# EAGLE design BareBonesArduino (EAGLE 7.2.0)
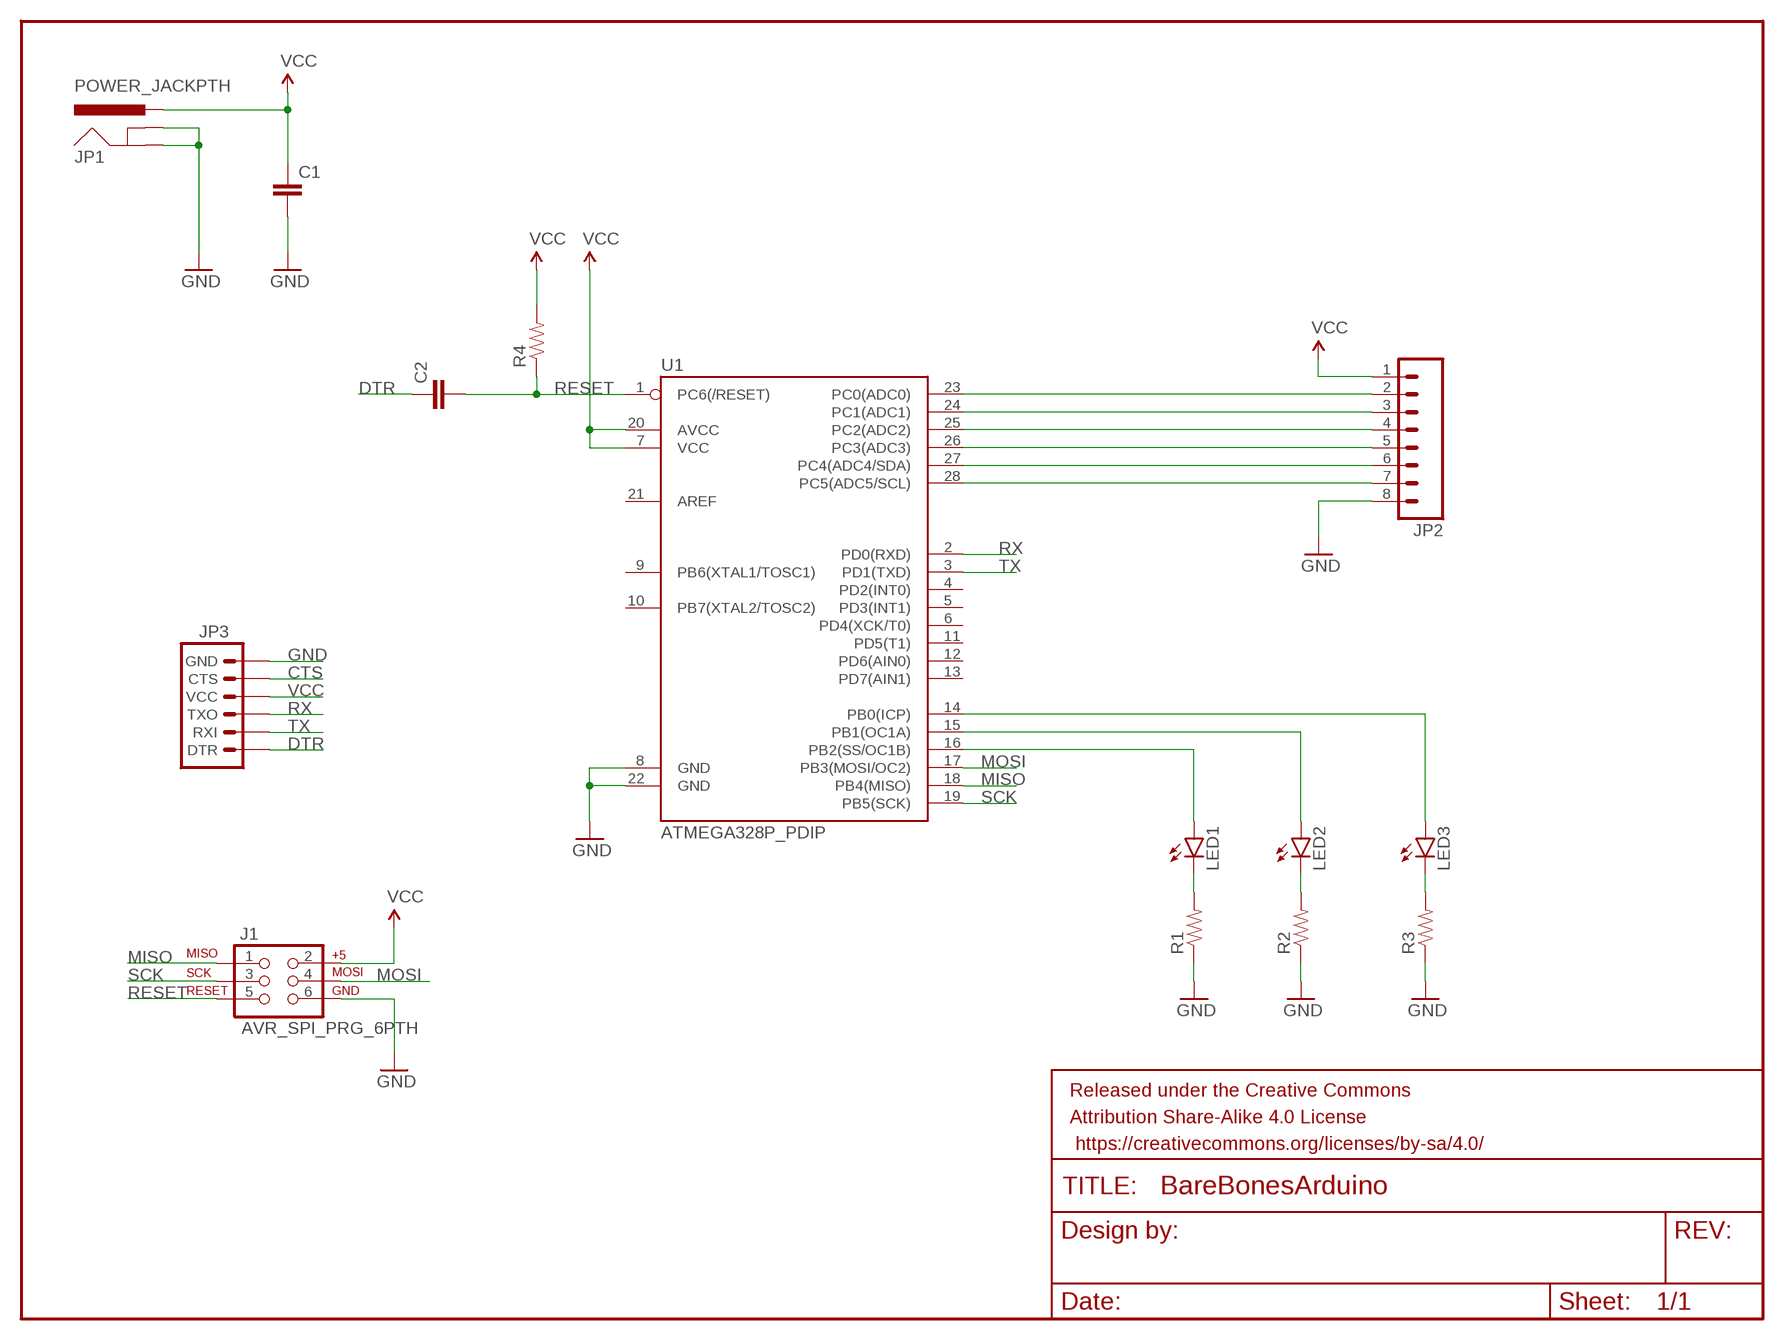
[diagram p0: schematic, sheet 1]

## Parts
C1  CAPPTH  [CAP-PTH-SMALL]
C2  CAPPTH  [CAP-PTH-SMALL]
FRAME1  FRAME-LETTER  [CREATIVE_COMMONS]
J1  AVR_SPI_PRG_6PTH  [2X3]
JP1  POWER_JACKPTH  [POWER_JACK_PTH]
JP2  M08  [1X08_ROUND]
JP3  ARDUINO_SERIAL_PROGRAMPTH  [1X06]
LED1  LED5MM  [LED5MM]
LED2  LED5MM  [LED5MM]
LED3  LED5MM  [LED5MM]
R1  RESISTORPTH-1/4W  [AXIAL-0.4]
R2  RESISTORPTH-1/4W  [AXIAL-0.4]
R3  RESISTORPTH-1/4W  [AXIAL-0.4]
R4  RESISTORPTH-1/4W  [AXIAL-0.4]
U1  ATMEGA328P_PDIP  [DIL28-3]

## Nets
CTS: JP3.5(CTS)
DTR: C2.1 JP3.1(DTR)
GND: C1.2 J1.6 JP1.GND JP1.GNDBREAK JP2.8 JP3.6(GND) R1.P$1 R2.P$1 R3.P$1 U1.8(GND) U1.22(GND)
MISO: J1.1 U1.18(PB4(MISO))
MOSI: J1.4 U1.17(PB3(MOSI/OC2))
N$2: LED3.K(C) R3.P$2
N$3: LED2.K(C) R2.P$2
N$4: LED1.K(C) R1.P$2
N$5: LED1.A U1.16(PB2(SS/OC1B))
N$6: LED2.A U1.15(PB1(OC1A))
N$7: LED3.A U1.14(PB0(ICP))
N$8: JP2.7 U1.28(PC5(ADC5/SCL))
N$9: JP2.6 U1.27(PC4(ADC4/SDA))
N$10: JP2.5 U1.26(PC3(ADC3))
N$11: JP2.4 U1.25(PC2(ADC2))
N$12: JP2.3 U1.24(PC1(ADC1))
N$13: JP2.2 U1.23(PC0(ADC0))
RESET: C2.2 J1.5 R4.P$1 U1.1(PC6(/RESET))
RX: JP3.3(TXO) U1.2(PD0(RXD))
SCK: J1.3 U1.19(PB5(SCK))
TX: JP3.2(RXI) U1.3(PD1(TXD))
VCC: C1.1 J1.2 JP1.PWR JP2.1 JP3.4(VCC) R4.P$2 U1.7(VCC) U1.20(AVCC)
Unconnected: U1.4(PD2(INT0)) U1.5(PD3(INT1)) U1.6(PD4(XCK/T0)) U1.9(PB6(XTAL1/TOSC1)) U1.10(PB7(XTAL2/TOSC2)) U1.11(PD5(T1)) U1.12(PD6(AIN0)) U1.13(PD7(AIN1)) U1.21(AREF)

## Library data of the parts
C1 C2 = SparkFun-Capacitors:CAP: Capacitor Standard 0603 ceramic capacitor, and 0.1" leaded capacitor.
FRAME1 = SparkFun-Aesthetics:FRAME-LETTER: Schematic Frame Standard 8.5x11 US Letter frame
J1 = SparkFun-Connectors:AVR_SPI_PRG_6: AVR ISP 6 Pin This is the reduced ISP connector for AVR programming. Common on Arduino. This footprint will take up less PCB space and can be used with a 10-pin to 6-pin adapter such as SKU: BOB-08508 **Special note about "TEST_POINT" package. The stop mask is on the top side, so if you want your programming test points to be on the bottom of your board, make sure to place this package on the bottom side of the board. This also ensure that the orientation to program from the bottom side will be correct.
JP1 = SparkFun-Connectors:POWER_JACK: Power Jack This is the standard 5.5mm barrel jack for power. The PTH is the most common, proven, reliable, footprint. The Slot footprint only works if the mill layer is transmitted to the PCB fab house so be warned. Mating wall wart : TOL-00298 (and others); PROD_ID: CONN-08197
JP2 = SparkFun-Connectors:M08: Header 8 Standard 8-pin 0.1" header. Use with straight break away headers (SKU : PRT-00116), right angle break away headers (PRT-00553), swiss pins (PRT-00743), machine pins (PRT-00117), and female headers (PRT-00115).
JP3 = SparkFun-Connectors:ARDUINO_SERIAL_PROGRAM: FTDI connector footprints
LED1-LED3 = SparkFun-LED:LED: LEDs Standard schematic elements and footprints for 5mm, 3mm, 1206, and 0603 sized LEDs. 5mm - Spark Fun Electronics SKU : COM-00529 (and others)
R1-R4 = SparkFun-Resistors:RESISTOR: Resistor Basic schematic elements and footprints for 0603, 1206, and PTH resistors.
U1 = SparkFun-DigitalIC:ATMEGA328P_PDIP: uC used in the Arduino 32kb flash, 1k EEPROM, 2k SRAM This is the through-hole version of this chip.

## Board
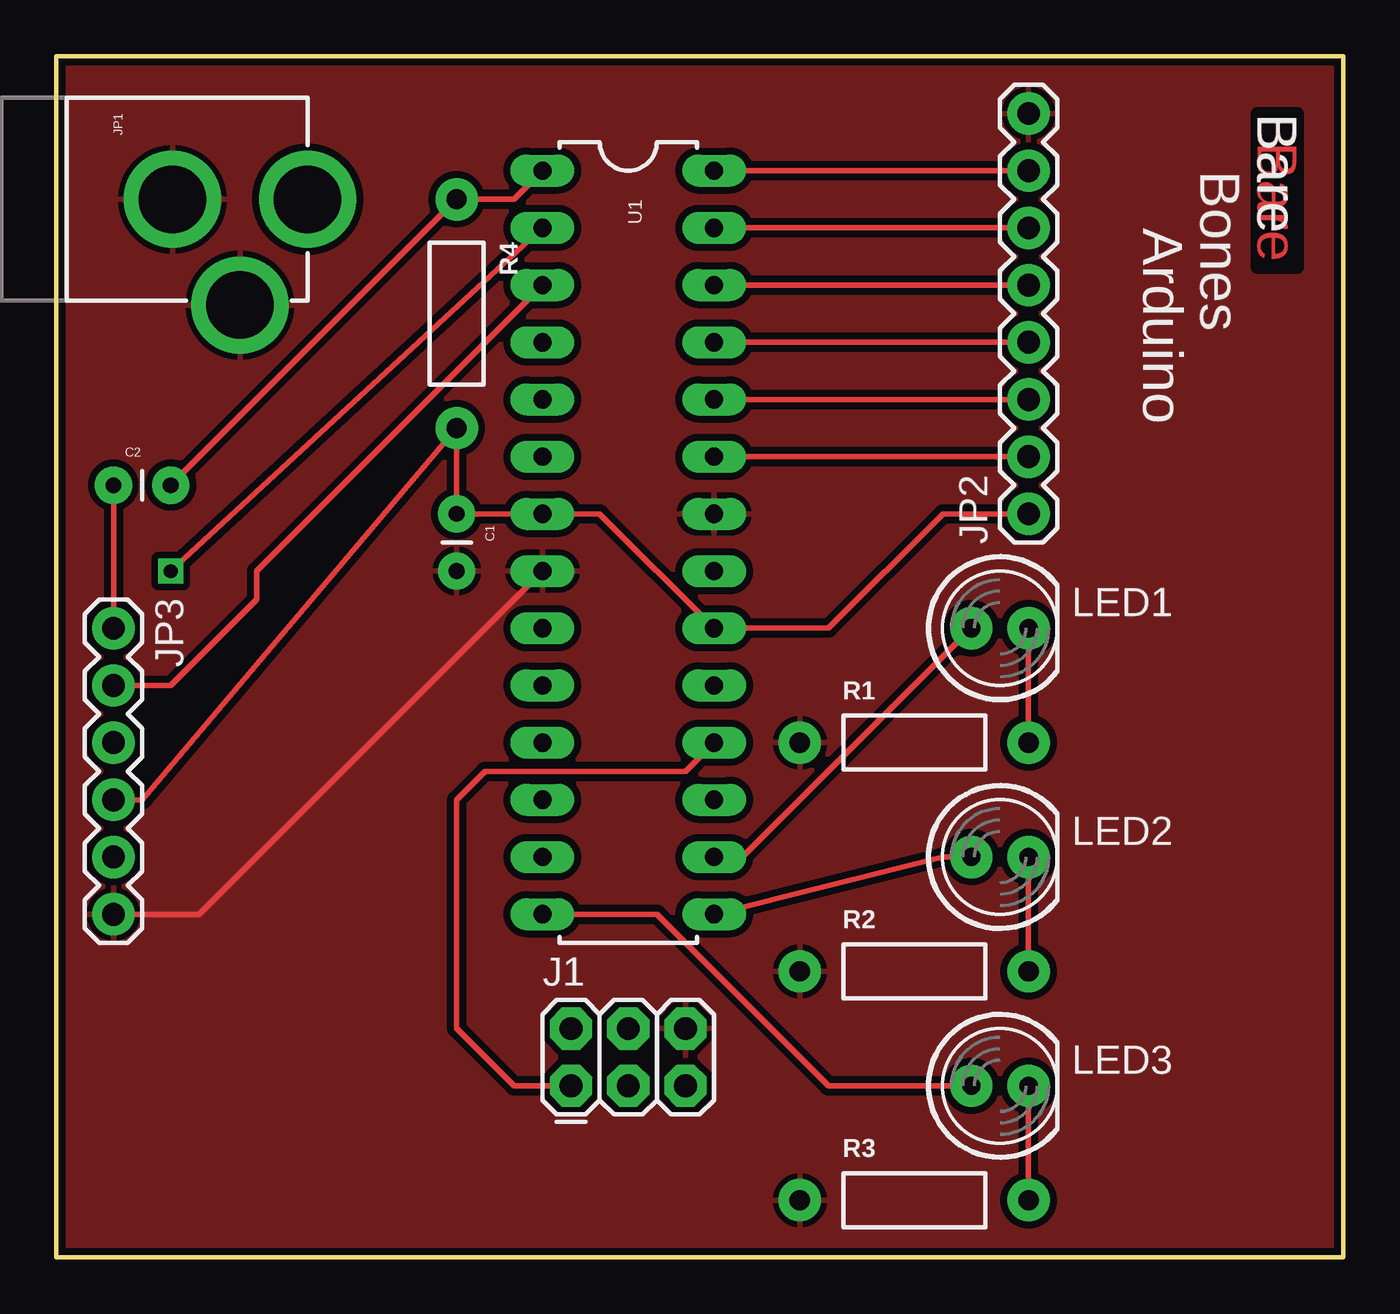
[diagram p1: board, top side]
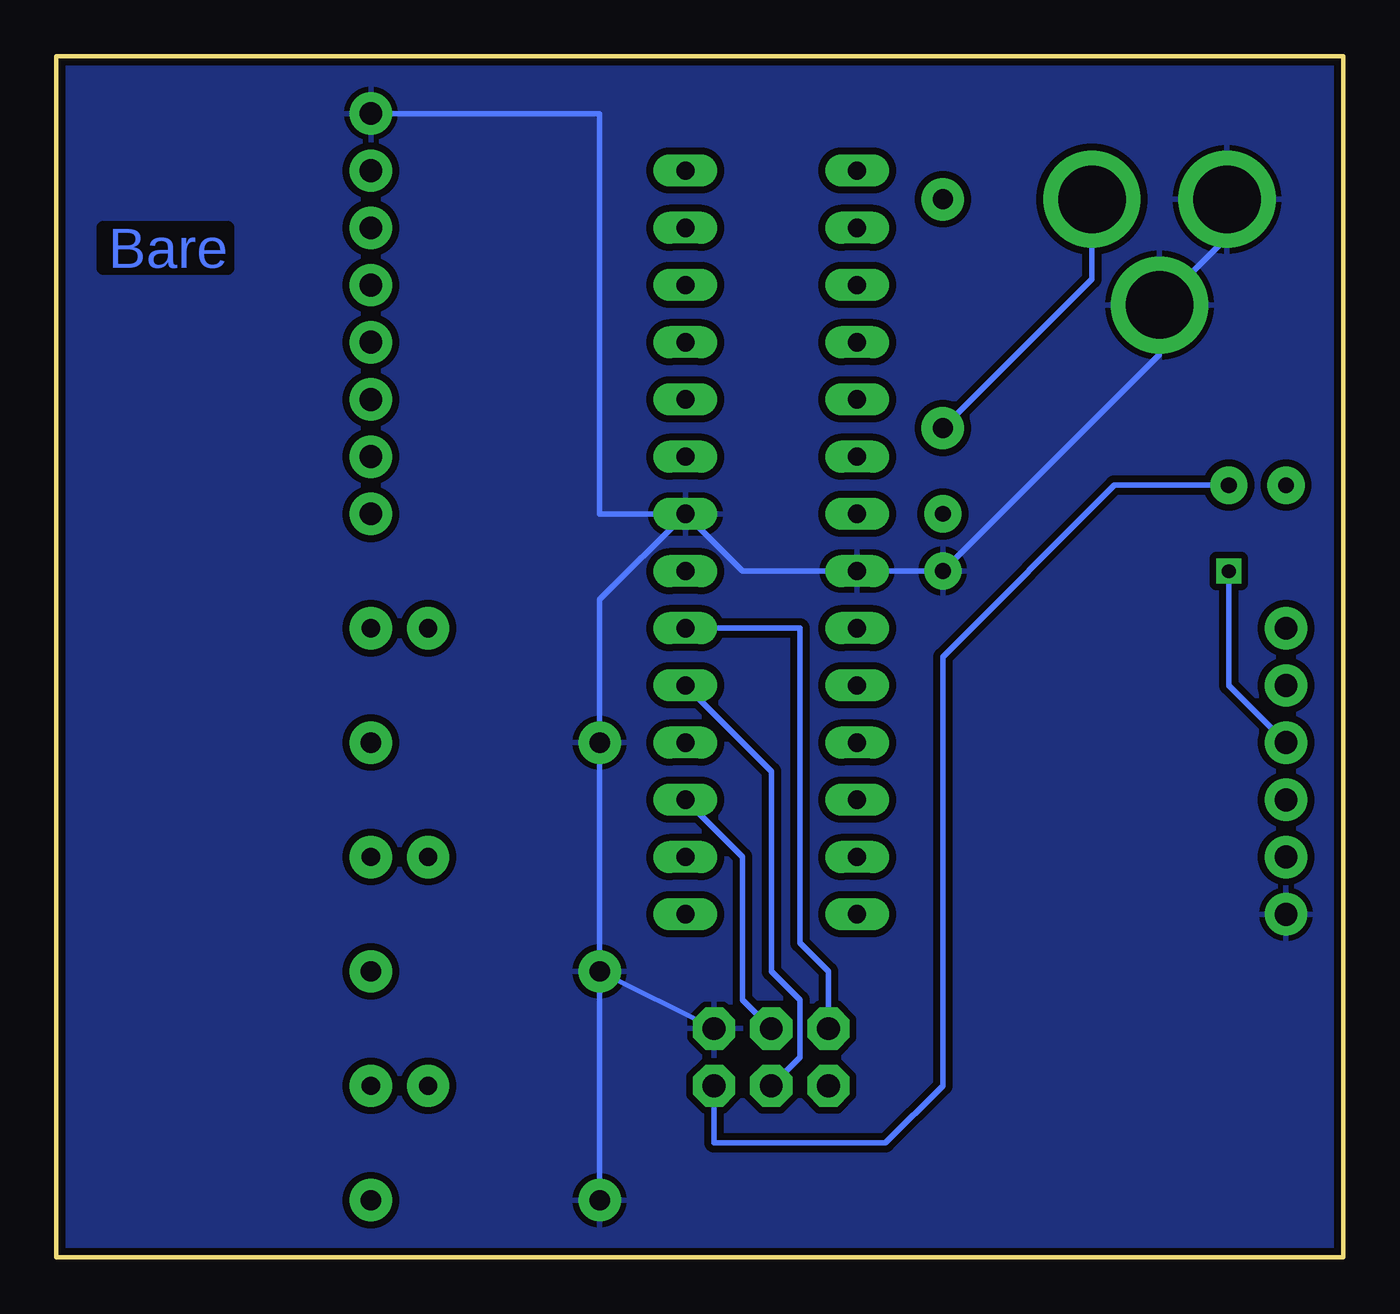
[diagram p2: board, bottom side, seen from below]

Size 57.15 x 53.34 mm. Coordinates in mm from the lower left corner, seen from the top.
Outline: 57.15,0 57.15,53.34 0,53.34 0,0 57.15,0
Copper layers (1*16): Top 0.035mm / dielectric 1.5mm / Bottom 0.035mm
Design rules "SparkFun": minimum track width 8mil, minimum drill 20mil, track to track 8mil, track to pad 8mil, pad to pad 8mil, via to via 8mil, smd to smd 8mil, copper to edge 8mil, drill to drill 8mil, minimum pad ring 12mil, minimum via ring 10mil, stop-mask expansion 4mil, vias tented up to drill 20mil, thermal gap 10mil

### Footprints (pad centres in the part's own frame; a part is rotated, then mirrored left to right if it is on the bottom)
CAP-PTH-SMALL = drill 0.7 pad 1.651: 1 0,0; 2 2.54,0
2X3 = drill 1.016 pad 1.88 octagon: 1 0,0; 2 0,2.54; 3 2.54,0; 4 2.54,2.54; 5 5.08,0; 6 5.08,2.54
POWER_JACK_PTH = drill 2.997 pad 4.318: GND 0,7.7; GNDBREAK 4.7,10.7; PWR 0,13.7
1X08_ROUND = drill 1.016 pad 1.88: 1 0,0; 2 2.54,0; 3 5.08,0; 4 7.62,0; 5 10.16,0; 6 12.7,0; 7 15.24,0; 8 17.78,0
1X06 = drill 1.016 pad 1.88: 1 0,0; 2 2.54,0; 3 5.08,0; 4 7.62,0; 5 10.16,0; 6 12.7,0
LED5MM = drill 0.813 pad 1.88: A -1.27,0; K 1.27,0
AXIAL-0.4 = drill 0.9 pad 1.88: P$1 -5.08,0; P$2 5.08,0
DIL28-3 = drill 0.813 long: 1 -16.51,-3.81; 2 -13.97,-3.81; 3 -11.43,-3.81; 4 -8.89,-3.81; 5 -6.35,-3.81; 6 -3.81,-3.81; 7 -1.27,-3.81; 8 1.27,-3.81; 9 3.81,-3.81; 10 6.35,-3.81; 11 8.89,-3.81; 12 11.43,-3.81; 13 13.97,-3.81; 14 16.51,-3.81; 15 16.51,3.81; 16 13.97,3.81; 17 11.43,3.81; 18 8.89,3.81; 19 6.35,3.81; 20 3.81,3.81; 21 1.27,3.81; 22 -1.27,3.81; 23 -3.81,3.81; 24 -6.35,3.81; 25 -8.89,3.81; 26 -11.43,3.81; 27 -13.97,3.81; 28 -16.51,3.81

### Placement (x,y rotation side)
C1  17.78,33.02 270 top
C2  2.54,34.29 0 top
FRAME1  -102.87,20.32 0 top  (outside the outline)
J1  22.86,7.62 0 top
JP1  -2.54,46.99 270 top
JP2  43.18,33.02 90 top
JP3  2.54,27.94 270 top
LED1  41.91,27.94 0 top
LED2  41.91,17.78 0 top
LED3  41.91,7.62 0 top
R1  38.1,22.86 0 top
R2  38.1,12.7 0 top
R3  38.1,2.54 0 top
R4  17.78,41.91 270 top
U1  25.4,31.75 270 top

### Tracks (layer width: path | path; a pad name or v marks a point on that pad's centre or on a via)
DTR
  Top 0.254: JP3.1 C2.1
GND
  Top 0.254: JP3.6 6.35,15.24 U1.8
  Bottom 0.254: JP1.GND 5.16,45.29 JP1.GNDBREAK 8.16,40.1 C1.2 U1.8 26.67,30.48 U1.22 | R2.P$1 R3.P$1 | R2.P$1 J1.6 | R2.P$1 R1.P$1 33.02,29.21 U1.22 | U1.22 33.02,33.02 33.02,50.8 JP2.8
  pour Top (isolate 0.305): 0,53.34 0,0 57.15,0 57.15,53.34
  pour Bottom (isolate 0.305): 0,53.34 0,0 57.15,0 57.15,53.34
MISO
  Top 0.254: J1.1 20.32,7.62 17.78,10.16 17.78,20.32 19.05,21.59 27.94,21.59 U1.18
MOSI
  Bottom 0.254: J1.4 26.67,11.43 26.67,17.78 U1.17
N$2
  Top 0.254: R3.P$2 LED3.K
N$3
  Top 0.254: R2.P$2 LED2.K
N$4
  Top 0.254: R1.P$2 LED1.K
N$5
  Top 0.254: U1.16 30.48,17.78 LED1.A
N$6
  Top 0.254: LED2.A 39.37,17.78 U1.15
N$7
  Top 0.254: U1.14 26.67,15.24 34.29,7.62 LED3.A
N$8
  Top 0.254: JP2.7 U1.28
N$9
  Top 0.254: JP2.6 U1.27
N$10
  Top 0.254: JP2.5 U1.26
N$11
  Top 0.254: JP2.4 U1.25
N$12
  Top 0.254: JP2.3 U1.24
N$13
  Top 0.254: JP2.2 U1.23
RESET
  Top 0.254: C2.2 R4.P$1 20.32,46.99 U1.1
  Bottom 0.254: C2.2 10.16,34.29 17.78,26.67 17.78,7.62 20.32,5.08 27.94,5.08 J1.5
RX  (via drill 0.6)
  Top 0.254: U1.2 v5.08,30.48
  Bottom 0.254: v5.08,30.48 5.08,25.4 JP3.3
SCK
  Bottom 0.254: U1.19 25.4,21.59 25.4,12.7 24.13,11.43 24.13,8.89 J1.3
TX
  Top 0.254: U1.3 8.89,30.48 8.89,29.21 5.08,25.4 JP3.2
VCC
  Top 0.254: JP3.4 3.81,20.32 R4.P$2 C1.1 U1.7 24.13,33.02 U1.20 34.29,27.94 39.37,33.02 JP2.1
  Bottom 0.254: JP1.PWR 11.16,43.45 R4.P$2 | J1.2 22.86,12.7 24.13,13.97 24.13,27.94 U1.20

### Text on the board
Top: Bare | Bare | Bare | Bare | Bare | Bare | Bare
Bottom: Bare
tPlace: Bare | Bones | Arduino